# EasyEDA Pro project ax08_duplicate.eprj, board condition
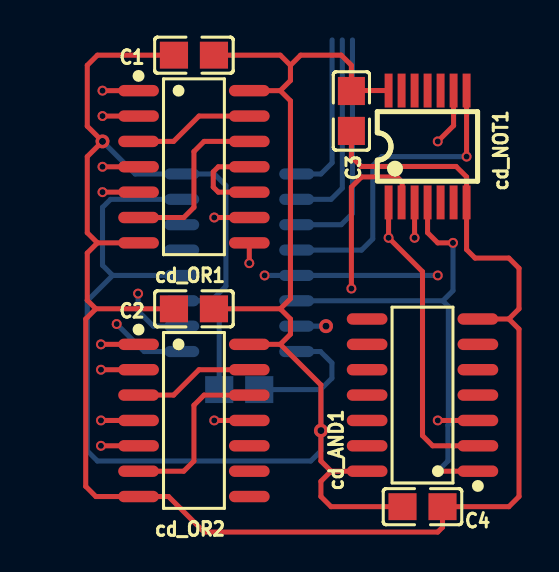
[diagram p11: board, top side]
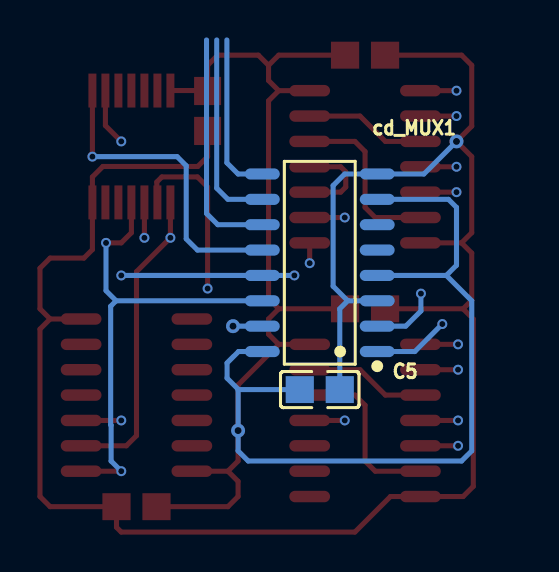
[diagram p12: board, bottom side, seen from below]

No outline. copper layers: Top Layer, Inner1, Inner2, Bottom Layer. Coordinates in mm from the lowest, leftmost part position.
Stack: Top Layer 0.035mm Outer layer thickness 1oz / Dielectric1 0.2104mm 7628 RC49% 8.6mil / Inner1 0.0152mm Inner layer thickness / Dielectric2 1.065mm 1.1mm H/HOZ Copper / Inner2 0.0152mm Inner layer thickness / Dielectric3 0.2104mm 7628 RC49% 8.6mil / Bottom Layer 0.035mm Outer layer thickness 1oz

## Design rules (mm)
template: JLCPCB Capability(Two Layers Board)
spacing copperThickness1oz (default): track to track 0.102, other pairs 0.152 to 0.3
spacing copperThickness2oz: track to track 0.203, other pairs 0.152 to 0.3
track width copperThickness1oz (default): min 0.127, default 0.254, max 2.54
track width copperThickness2oz: min 0.203, default 0.254, max 2.54
differential pair differentialPair (default): width min 0.127, default 0.254, max 2.54; gap min 0.152, default 0.152
via viaSize (default): diameter min 0.5, default 0.61, max 10; hole min 0.3, default 0.305, max 6.3

## Placement (name value [footprint] x y rotation side)
C1  100nF  [C0805]  0 22.61 0 top
C2  100nF  [C0805]  0 9.91 0 top
C3  100nF  [C0805]  7.87 19.81 90 top
C4  100nF  [C0805]  11.43 0 180 top
C5  100nF  [C0805]  2.26 5.86 0 bottom
cd_AND1  MC14081BDR2G  [SOIC-14_L8.7-W3.9-P1.27-LS6.0-BL]  11.43 5.59 90 top
cd_MUX1  74HC151S  [SOP-16_L10.2-W3.9-P1.27-LS6.0-BL]  2.26 12.21 90 bottom
cd_NOT1  74HC14PW,118  [TSSOP-14_L5.0-W4.4-P0.65-LS6.4-BL]  11.68 18.03 0 top
cd_OR1  SN74HC32DR  [SOIC-14_L8.7-W3.9-P1.27-LS6.0-BL]  0 17.02 270 top
cd_OR2  SN74HC32DR  [SOIC-14_L8.7-W3.9-P1.27-LS6.0-BL]  0 4.32 270 top

## Footprints (pads in the part's own frame, mm; a bottom-side part is the same pattern mirrored in y, then rotated)
C0805
  rect 1.41x1.35 smd: 1(-1,0) 2(1,0)
SOIC-14_L8.7-W3.9-P1.27-LS6.0-BL
  oval 0.574x2.038 smd: 1(-3.81,-2.769) 2(-2.54,-2.769) 3(-1.27,-2.769) 4(0,-2.769) 5(1.27,-2.769) 6(2.54,-2.769) 7(3.81,-2.769) 8(3.81,2.769) 9(2.54,2.769) 10(1.27,2.769) 11(0,2.769) 12(-1.27,2.769) 13(-2.54,2.769) 14(-3.81,2.769)
SOP-16_L10.2-W3.9-P1.27-LS6.0-BL
  oval 0.56x1.745 smd: 1(-4.445,-2.873) 2(-3.175,-2.873) 3(-1.905,-2.873) 4(-0.635,-2.873) 5(0.635,-2.873) 6(1.905,-2.873) 7(3.175,-2.873) 8(4.445,-2.873) 9(4.445,2.873) 10(3.175,2.873) 11(1.905,2.873) 12(0.635,2.873) 13(-0.635,2.873) 14(-1.905,2.873) 15(-3.175,2.873) 16(-4.445,2.873)
TSSOP-14_L5.0-W4.4-P0.65-LS6.4-BL
  rect 0.4x1.7 smd: 1(-1.95,-2.8) 2(-1.3,-2.8) 3(-0.65,-2.8) 4(0,-2.8) 5(0.65,-2.8) 6(1.3,-2.8) 7(1.95,-2.8) 8(1.95,2.8) 9(1.3,2.8) 10(0.65,2.8) 11(0,2.8) 12(-0.65,2.8) 13(-1.3,2.8) 14(-1.95,2.8)

## Nets
As in the schematic.

Pads without a net: cd_AND1 4 5 6 8 9 10 11 12 13; cd_MUX1 6; cd_NOT1 5 6 10 11 12 13; cd_OR2 8 9 10

## Via types
v1: diameter 0.7, hole 0.35, Top Layer to Bottom Layer, 3 vias
v2: diameter 0.5, hole 0.3, Top Layer to Bottom Layer, 23 vias

## Routing (per net, layer and track width the routed paths; a pad name or vN(x,y) marks a point on that pad's centre or on a via; arc(x,y) is an arc through that point)
+5V: length 89.4
  Top Layer w0.254: C4.2 6.86,0 6.35,0.51 6.35,1.27 6.86,1.78 ; 4.32,20.83 cd_OR1.14 ; 4.32,20.83 4.83,20.32 4.83,10.41 4.32,9.91 ; 4.32,20.83 4.83,21.34 4.83,22.1 ; 4.83,22.1 5.33,22.61 7.37,22.61 7.87,22.1 C3.2 7.9,20.83 cd_NOT1.14 ; 4.83,22.1 4.32,22.61 C1.2 ; 6.86,1.78 8.66,1.78 ; 6.86,1.78 6.35,2.29 v1(6.35,3.81) 6.35,6.1 4.32,8.13 ; 4.32,9.91 4.83,9.4 4.83,8.64 4.32,8.13 ; 4.32,9.91 C2.2 ; 4.32,8.13 cd_OR2.14
  Bottom Layer w0.254: cd_MUX1.7 -4.17,15.39 -4.57,14.99 -4.57,12.09 -4.06,11.58 ; 6.33,5.86 6.9,6.43 6.9,7.2 6.33,7.77 cd_MUX1.16 ; 6.33,5.86 C5.2 ; 6.33,5.86 6.35,5.84 v1(6.35,3.81) 6.35,2.79 5.84,2.29 -4.83,2.29 -5.33,2.79 -5.33,10.31 -4.06,11.58 ; -4.06,11.58 cd_MUX1.4
GND: length 103.6
  Top Layer w0.254: C3.1 7.87,17.53 8.37,17.03 13.11,17.03 13.63,16.51 cd_NOT1.7 13.63,12.87 14.06,12.45 15.75,12.45 16.26,11.94 16.26,9.91 15.75,9.4 ; -4.83,13.21 -5.33,12.7 -5.33,10.34 -4.9,9.91 ; -4.83,13.21 -5.33,13.72 -5.33,17.53 v1(-4.57,18.29) -5.33,19.05 -5.33,22.1 -4.83,22.61 C1.1 ; -4.83,13.21 cd_OR1.7 ; -2.85,0.51 -4.9,0.51 -5.41,1.02 -5.41,9.4 -4.9,9.91 ; 15.75,9.4 cd_AND1.7 ; 15.75,9.4 16.26,8.89 16.26,0.51 15.75,0 C4.1 12.43,-1.03 12.19,-1.27 0.51,-1.27 -1.27,0.51 cd_OR2.7 ; -1.08,9.91 -4.9,9.91
  Bottom Layer w0.254: cd_MUX1.3 0.87,10.31 ; 0.87,10.31 1.6,11.04 1.6,16.08 1.02,16.66 cd_MUX1.8 -2.94,16.66 v1(-4.57,18.29) ; 0.87,10.31 1.26,9.91 C5.1
C0: length 4.9
  Top Layer w0.254: cd_OR1.1 v2(-4.57,20.83)
  Inner1 w0.254: v2(-4.57,20.83) -7.62,20.83
C1: length 4.9
  Top Layer w0.254: cd_OR1.2 v2(-4.57,19.56)
  Inner1 w0.254: v2(-4.57,19.56) -7.62,19.56
C2: length 4.9
  Top Layer w0.254: cd_OR1.4 v2(-4.57,17.02)
  Inner1 w0.254: v2(-4.57,17.02) -7.62,17.02
C3: length 4.9
  Top Layer w0.254: cd_OR1.5 v2(-4.57,15.75)
  Inner1 w0.254: v2(-4.57,15.75) -7.62,15.75
C4: length 4.9
  Top Layer w0.254: -2.85,8.13 v2(-4.65,8.13)
  Inner1 w0.254: v2(-4.65,8.13) -7.7,8.13
C5: length 4.9
  Top Layer w0.254: -2.85,6.86 v2(-4.65,6.86)
  Inner1 w0.254: v2(-4.65,6.86) -7.7,6.86
C6: length 4.9
  Top Layer w0.254: -2.85,4.32 v2(-4.65,4.32)
  Inner1 w0.254: v2(-4.65,4.32) -7.7,4.32
C7: length 38.1
  Top Layer w0.254: -2.85,3.05 v2(-4.65,3.05) ; cd_NOT1.3 v2(11.03,13.46)
  Inner1 w0.254: v2(11.03,13.46) 11.03,9.66 10.41,9.04 ; 10.41,9.04 11.03,8.42 11.03,3.67 10.41,3.05 v2(-4.65,3.05) -7.62,3.05 ; 10.41,9.04 v1(6.6,9.04)
  Bottom Layer w0.254: cd_MUX1.15 v1(6.6,9.04)
CD_INPUT_EQ: length 23.1
  Top Layer w0.254: cd_NOT1.2 10.41,15.26 10.41,16.26 10.16,16.51 8.38,16.51 7.87,16 v2(7.87,10.92)
  Inner1 w0.254: v2(7.87,10.92) 7.62,10.67 v2(-2.79,10.67)
  Bottom Layer w0.254: v2(-2.79,10.67) -2.79,9.8 -2.03,9.04 cd_MUX1.2
CD_INPUT_GE: length 24.3
  Top Layer w0.254: v2(12.95,13.21) 12.19,13.21 11.68,13.72 cd_NOT1.4 ; cd_AND1.1 v2(12.19,1.78)
  Bottom Layer w0.254: v2(12.19,1.78) 12.7,2.29 12.7,4.08 12.72,4.1 12.72,10.03 12.45,10.31 ; 12.45,10.31 12.95,10.82 v2(12.95,13.21) ; 12.45,10.31 cd_MUX1.14
CD_INPUT_GT: length 27.5
  Top Layer w0.254: v2(12.19,18.29) 12.98,19.08 cd_NOT1.9 ; cd_AND1.3 v2(12.19,4.32)
  Inner2 w0.254: v2(12.19,18.29) v2(12.19,11.58) v2(12.19,4.32)
  Bottom Layer w0.254: v2(12.19,11.58) cd_MUX1.13 v2(3.53,11.58)
CD_INPUT_LE: length 15.9
  Top Layer w0.254: cd_NOT1.8 v2(13.63,17.53)
  Bottom Layer w0.254: cd_MUX1.12 8.38,12.85 8.94,13.41 8.94,17.07 9.4,17.53 v2(13.63,17.53)
CD_INPUT_NE: length 37.5
  Top Layer w0.254: cd_AND1.2 11.94,3.05 11.43,3.56 11.43,11.77 v2(9.73,13.46) cd_NOT1.1 ; cd_OR1.8 v2(2.77,12.19)
  Inner1 w0.254: v2(-3.86,9.14) -3.86,11.63 -3.3,12.19 v2(2.77,12.19) 9.23,12.19 9.73,12.7 v2(9.73,13.46)
  Bottom Layer w0.254: cd_MUX1.1 -2.49,7.77 v2(-3.86,9.14)
OP_CD0: length 11.7
  Bottom Layer w0.254: 7.93,23.37 7.93,14.68 7.37,14.12 cd_MUX1.11
OP_CD1: length 9.9
  Bottom Layer w0.254: 7.42,23.37 7.42,15.95 6.86,15.39 cd_MUX1.10
OP_CD2: length 8.2
  Bottom Layer w0.254: cd_MUX1.9 6.35,16.66 6.91,17.22 6.91,23.37
$1N582: length 6.1
  Top Layer w0.254: cd_OR1.13 0.25,19.56 -1.02,18.29 cd_OR1.3
$1N593: length 8.8
  Top Layer w0.254: cd_OR1.12 0.51,18.29 0,17.78 0,14.99 -0.51,14.48 cd_OR1.6
$1N762: length 6.1
  Top Layer w0.254: cd_OR2.13 0.25,6.86 -1.02,5.59 cd_OR2.3
$1N768: length 8.8
  Top Layer w0.254: cd_OR2.6 -0.51,1.78 0,2.29 0,5.08 0.51,5.59 cd_OR2.12
$1N778: length 4.6
  Top Layer w0.254: cd_OR1.10 1.22,15.75 0.97,16 0.97,16.76 1.22,17.02 cd_OR1.11
$1N808: length 13.7
  Top Layer w0.254: cd_OR2.11 v2(1.02,4.32) ; cd_OR1.9 v2(1.02,14.48)
  Inner2 w0.254: v2(1.02,14.48) v2(1.02,4.32)
